# Altium project Switch Video con PIC.PRJPCB
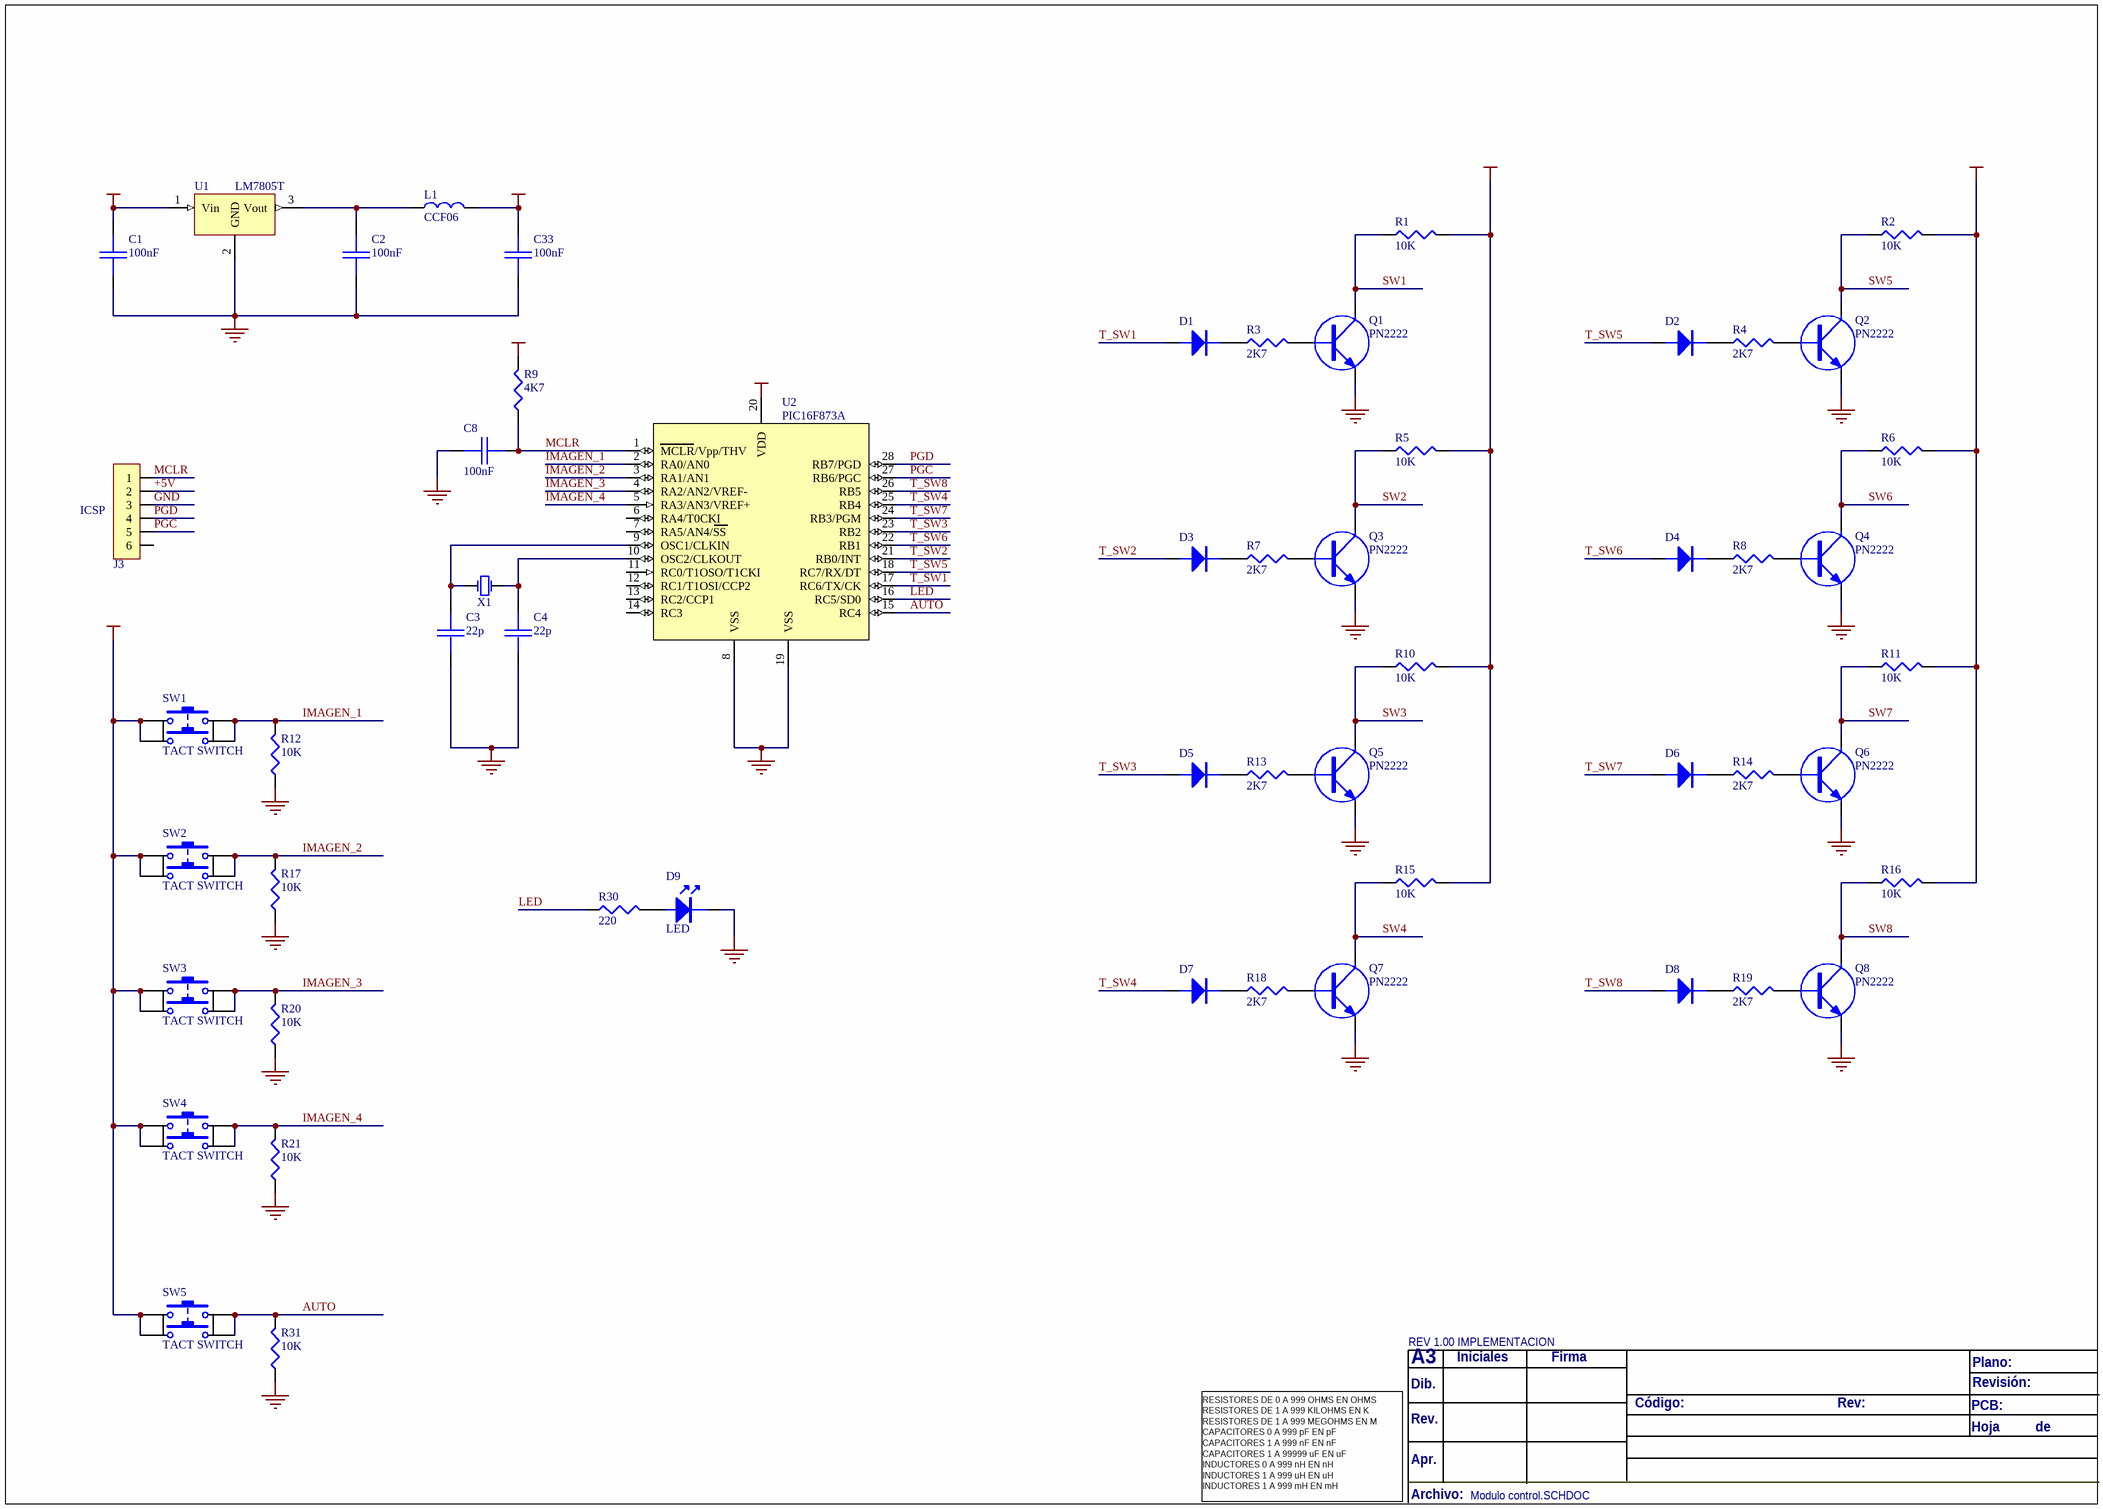
[diagram p0: Modulo control.SCHDOC]
2 sheets, 138 parts. Net scope: global (net labels, ports and power ports of the same name join across sheets).
Board files: Switch Video con PIC.PCBDOC, Armado.PCBDOC
Sheets:
  Modulo control.SCHDOC
  Switch Video con PIC.SCHDOC

## Sheet Modulo control.SCHDOC
size A3; PageSetup: Record=PageOptions|CenterHorizontal=True|CenterVertical=True|PrintScale=0.50|XCorrection=1.00|YCorrection=1.00|PrintKind=1|BorderSize=5000000|LeftOffset=0|BottomOffset=0|Orientation=1|PaperLength=1000|PaperWidth=1000|Scale=100|PaperSource=7|PrintQuality=-4|MediaType=1|DitherType=10|PaperKind=A4|PrintScaleMode=1

### Parts
C1  100nF  [0805]
C2  100nF  [0805]
C3  22p  [CAP5.08]
C4  22p  [CAP5.08]
C8  100nF  [0805]
C33  100nF  [0805]
D1  1N4148 DO-35  [DO-35_300]  (value not drawn)
D2  1N4148 DO-35  [DO-35_300]  (value not drawn)
D3  1N4148 DO-35  [DO-35_300]  (value not drawn)
D4  1N4148 DO-35  [DO-35_300]  (value not drawn)
D5  1N4148 DO-35  [DO-35_300]  (value not drawn)
D6  1N4148 DO-35  [DO-35_300]  (value not drawn)
D7  1N4148 DO-35  [DO-35_300]  (value not drawn)
D8  1N4148 DO-35  [DO-35_300]  (value not drawn)
D9  LED  [LED 3MM]
J3  HEADER6  [JUMPER_6A]  (value not drawn)
L1  CCF06  [AXIAL10X4_300]
Q1  PN2222  [TO-92C]
Q2  PN2222  [TO-92C]
Q3  PN2222  [TO-92C]
Q4  PN2222  [TO-92C]
Q5  PN2222  [TO-92C]
Q6  PN2222  [TO-92C]
Q7  PN2222  [TO-92C]
Q8  PN2222  [TO-92C]
R1  10K  [RES_MF1/2W_200]
R2  10K  [RES_MF1/2W_200]
R3  2K7  [RES_MF1/2W_200]
R4  2K7  [RES_MF1/2W_200]
R5  10K  [RES_MF1/2W_200]
R6  10K  [RES_MF1/2W_200]
R7  2K7  [RES_MF1/2W_200]
R8  2K7  [RES_MF1/2W_200]
R9  4K7  [RES_MF1/2W_200]
R10  10K  [RES_MF1/2W_200]
R11  10K  [RES_MF1/2W_200]
R12  10K  [RES_MF1/2W_200]
R13  2K7  [RES_MF1/2W_200]
R14  2K7  [RES_MF1/2W_200]
R15  10K  [RES_MF1/2W_200]
R16  10K  [RES_MF1/2W_200]
R17  10K  [RES_MF1/2W_200]
R18  2K7  [RES_MF1/2W_200]
R19  2K7  [RES_MF1/2W_200]
R20  10K  [RES_MF1/2W_200]
R21  10K  [RES_MF1/2W_200]
R30  220  [0805]
R31  10K  [RES_MF1/2W_200]
SW1  TACT SWITCH  [PULSADOR 6X6]
SW2  TACT SWITCH  [PULSADOR 6X6]
SW3  TACT SWITCH  [PULSADOR 6X6]
SW4  TACT SWITCH  [PULSADOR 6X6]
SW5  TACT SWITCH  [PULSADOR 6X6]
U1  LM7805T  [TO-220_1]
U2  PIC16F873A  [DIP28F]
X1  XL20M-UM5  [UM5]  (value not drawn)

### Nets
+5V: C33.1 J3.2 L1.2 R9.2 SW1.1 SW1.3 SW2.1 SW2.3 SW3.1 SW3.3 SW4.1 SW4.3 SW5.1 SW5.3 U2.20(VDD)
GND: C1.2 C2.2 C3.1 C4.1 C8.1 C33.2 D9.K J3.3 Q1.1(E) Q2.1(E) Q3.1(E) Q4.1(E) Q5.1(E) Q6.1(E) Q7.1(E) Q8.1(E) R12.1 R17.1 R20.1 R21.1 R31.1 U1.2(GND) U2.8(VSS) U2.19(VSS)
VCC: C1.1 R1.2 R2.2 R5.2 R6.2 R10.2 R11.2 R15.2 R16.2 U1.1(Vin)
AUTO: R31.2 SW5.2 SW5.4 U2.15(RC4)
IMAGEN_1: R12.2 SW1.2 SW1.4 U2.2(RA0/AN0)
IMAGEN_2: R17.2 SW2.2 SW2.4 U2.3(RA1/AN1)
IMAGEN_3: R20.2 SW3.2 SW3.4 U2.4(RA2/AN2/VREF-)
IMAGEN_4: R21.2 SW4.2 SW4.4 U2.5(RA3/AN3/VREF+)
LED: R30.1 U2.16(RC5/SD0)
MCLR: C8.2 J3.1 R9.1 U2.1(MCLR/Vpp/THV)
PGC: J3.5 U2.27(RB6/PGC)
PGD: J3.4 U2.28(RB7/PGD)
SW1: Q1.3(C) R1.1
SW2: Q3.3(C) R5.1
SW3: Q5.3(C) R10.1
SW4: Q7.3(C) R15.1
SW5: Q2.3(C) R2.1
SW6: Q4.3(C) R6.1
SW7: Q6.3(C) R11.1
SW8: Q8.3(C) R16.1
T_SW1: D1.A U2.17(RC6/TX/CK)
T_SW2: D3.A U2.21(RB0/INT)
T_SW3: D5.A U2.23(RB2)
T_SW4: D7.A U2.25(RB4)
T_SW5: D2.A U2.18(RC7/RX/DT)
T_SW6: D4.A U2.22(RB1)
T_SW7: D6.A U2.24(RB3/PGM)
T_SW8: D8.A U2.26(RB5)
NetC2_1: C2.1 L1.1 U1.3(Vout)
NetC3_2: C3.2 U2.9(OSC1/CLKIN) X1.2(OSC2)
NetC4_2: C4.2 U2.10(OSC2/CLKOUT) X1.1(OSC1)
NetD1_K: D1.K R3.1
NetD2_K: D2.K R4.1
NetD3_K: D3.K R7.1
NetD4_K: D4.K R8.1
NetD5_K: D5.K R13.1
NetD6_K: D6.K R14.1
NetD7_K: D7.K R18.1
NetD8_K: D8.K R19.1
NetD9_A: D9.A R30.2
NetQ1_2: Q1.2(B) R3.2
NetQ2_2: Q2.2(B) R4.2
NetQ3_2: Q3.2(B) R7.2
NetQ4_2: Q4.2(B) R8.2
NetQ5_2: Q5.2(B) R13.2
NetQ6_2: Q6.2(B) R14.2
NetQ7_2: Q7.2(B) R18.2
NetQ8_2: Q8.2(B) R19.2

Not connected (* = marked no-connect by the designer): J3 6; U2 6(RA4/T0CKI) 7(RA5/AN4/SS) 11(RC0/T1OSO/T1CKI) 12(RC1/T1OSI/CCP2) 13(RC2/CCP1) 14(RC3)

### Notes on the sheet
- (near J3) ICSP
- REV 1.00 IMPLEMENTACION
- Dib.
- A3
- Iniciales
- Firma
- Plano:
- Revisión:
- Rev.
- Apr.
- Código:
- Rev:
- Hoja          de
- PCB:
- RESISTORES DE 0 A 999 OHMS EN OHMS
  RESISTORES DE 1 A 999 KILOHMS EN K
  RESISTORES DE 1 A 999 MEGOHMS EN M
  CAPACITORES 0 A 999 pF EN pF
  CAPACITORES 1 A 999 nF EN nF
  CAPACITORES 1 A 99999 uF EN uF
  INDUCTORES 0 A 999 nH EN nH
  INDUCTORES 1 A 999 uH EN uH
  INDUCTORES 1 A 999 mH EN mH
- Archivo:

### Library data of the parts
C1 C2 C8 C33 = 100n: CAPACITOR SMD 0805 X7R  50 V 100 nF; CODIGO: YSBC104AAG
C3 C4 = 22p: CAPACITOR PLATE NP0 100V PASO 2.54 mm 22 pF; CODIGO: YPA0220BAG
D1-D8 = 1N4148 DO-35: 1N4148 DO-35 DIODO; CODIGO: DR00006ABH
D9 = LED AMARILLO 3MM: CODIGO: DLRA030XCG
J3 = HEADER6: TIRA MOLEX 1X6 11MM MACHO RECTA PARA PCB
L1 = CCF06: INDUCTOR CCF06; CODIGO: LC0000003G
Q1-Q8 = PN2222: PN2222 TO-92 NPN TRANSISTOR; CODIGO: QS00001AAG
R1 R2 R5 R6 R10-R12 R15-R17 R20 R21 R31 = 10K: RESISTOR METAL FILM 0.5 W 5% 10 KILOHMS; CODIGO: RMC00103EG
R3 R4 R7 R8 R13 R14 R18 R19 = 2K7: RESISTOR METAL FILM 0.5 W 5% 2.7 KILOHMS; CODIGO: RMC00272EG
R9 = 4K7: RESISTOR METAL FILM 0.5 W 5% 4.7 KILOHMS; CODIGO: RMC00472EG
R30 = 220: RESISTOR SMD0805 0.125 W 5%  220 OHMS; CODIGO: RSB00221EG
SW1-SW5 = SW-PB: TACT SWITCH 6X6X12MM 4PINES TSWTS065; CODIGO: KM0000001H
U1 = LM7805T: LM7805T TO-220 CIRC INT; CODIGO: UV00001EBG
U2 = PIC-16F873A: PIC-16F873A - I/SP DIP28 7.62 MM; CODIGO: UI00001AMG
X1 = XL20M-UM5: XL20M-UM5 CRISTAL DE 20 MHZ 10ppm; CODIGO: XXAC00012H

## Sheet Switch Video con PIC.SCHDOC
size A3; PageSetup: Record=PageOptions|CenterHorizontal=True|CenterVertical=True|PrintScale=0.50|XCorrection=1.00|YCorrection=1.00|PrintKind=1|BorderSize=5000000|LeftOffset=0|BottomOffset=0|Orientation=1|PaperLength=1000|PaperWidth=1000|Scale=100|PaperSource=7|PrintQuality=-4|MediaType=1|DitherType=10|PaperKind=A4|PrintScaleMode=1
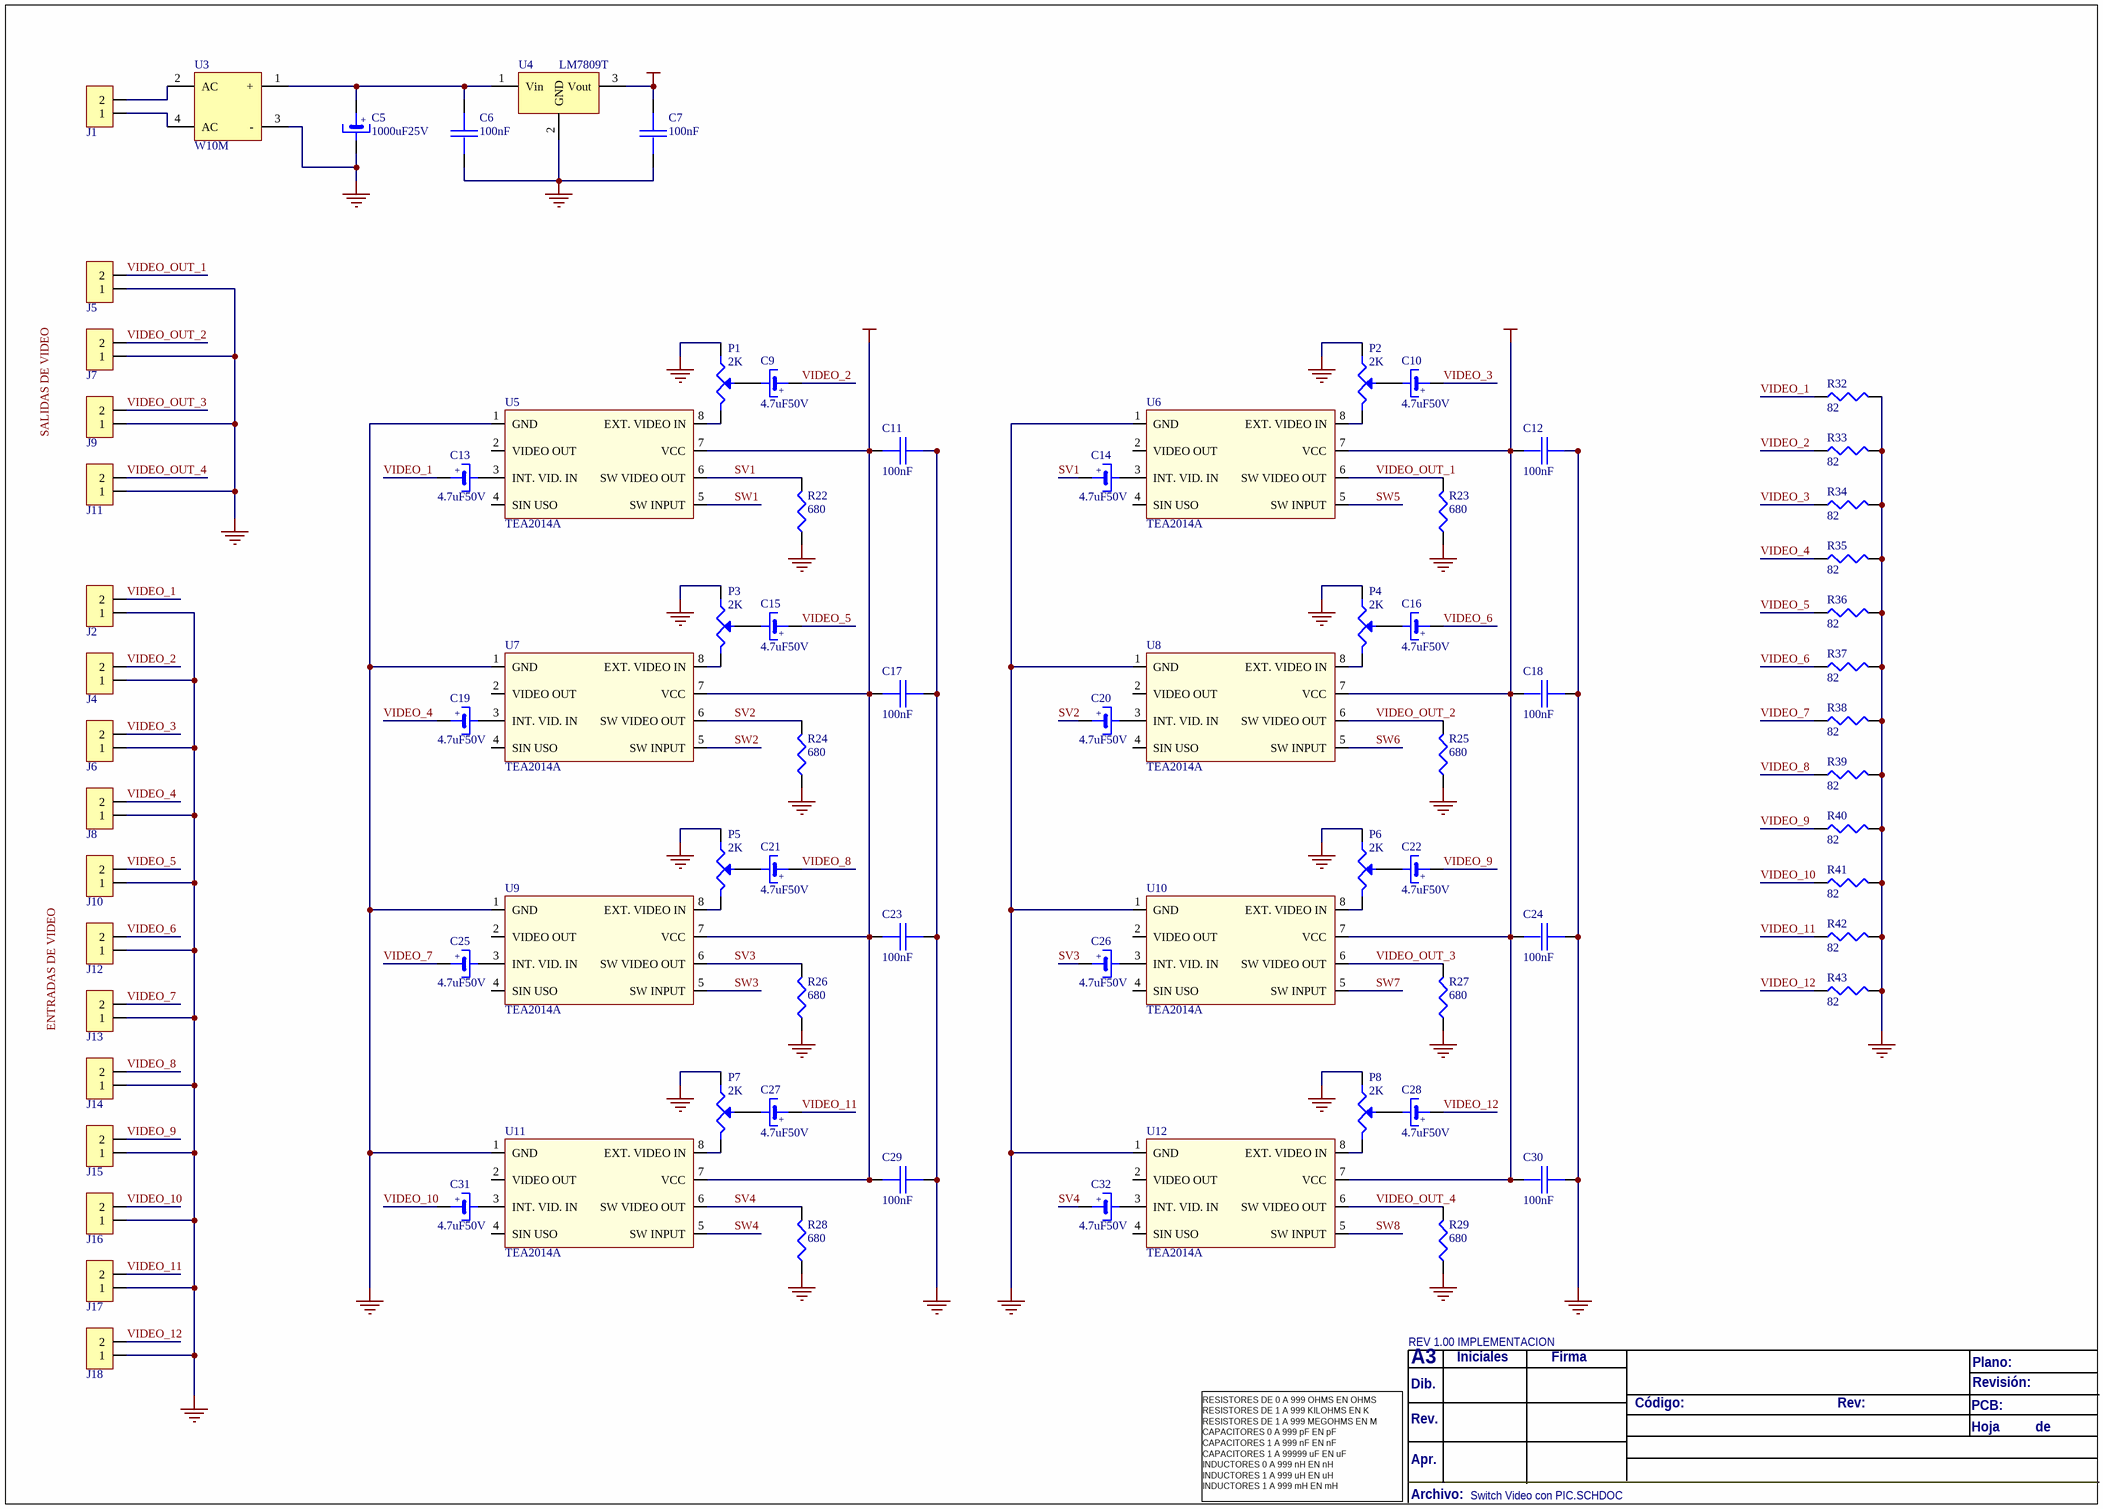
[diagram p1: Switch Video con PIC.SCHDOC]

### Parts
C5  1000uF25V  [CE 5.0/12.5]
C6  100nF  [0805]
C7  100nF  [0805]
C9  4.7uF50V  [CE 2.5/5.0]
C10  4.7uF50V  [CE 2.5/5.0]
C11  100nF  [CAP5.08]
C12  100nF  [CAP5.08]
C13  4.7uF50V  [CE 2.5/5.0]
C14  4.7uF50V  [CE 2.5/5.0]
C15  4.7uF50V  [CE 2.5/5.0]
C16  4.7uF50V  [CE 2.5/5.0]
C17  100nF  [CAP5.08]
C18  100nF  [CAP5.08]
C19  4.7uF50V  [CE 2.5/5.0]
C20  4.7uF50V  [CE 2.5/5.0]
C21  4.7uF50V  [CE 2.5/5.0]
C22  4.7uF50V  [CE 2.5/5.0]
C23  100nF  [CAP5.08]
C24  100nF  [CAP5.08]
C25  4.7uF50V  [CE 2.5/5.0]
C26  4.7uF50V  [CE 2.5/5.0]
C27  4.7uF50V  [CE 2.5/5.0]
C28  4.7uF50V  [CE 2.5/5.0]
C29  100nF  [CAP5.08]
C30  100nF  [CAP5.08]
C31  4.7uF50V  [CE 2.5/5.0]
C32  4.7uF50V  [CE 2.5/5.0]
J1  PW2S  [PW2S]  (value not drawn)
J2  PW2S  [PW2S]  (value not drawn)
J4  PW2S  [PW2S]  (value not drawn)
J5  PW2S  [PW2S]  (value not drawn)
J6  PW2S  [PW2S]  (value not drawn)
J7  PW2S  [PW2S]  (value not drawn)
J8  PW2S  [PW2S]  (value not drawn)
J9  PW2S  [PW2S]  (value not drawn)
J10  PW2S  [PW2S]  (value not drawn)
J11  PW2S  [PW2S]  (value not drawn)
J12  PW2S  [PW2S]  (value not drawn)
J13  PW2S  [PW2S]  (value not drawn)
J14  PW2S  [PW2S]  (value not drawn)
J15  PW2S  [PW2S]  (value not drawn)
J16  PW2S  [PW2S]  (value not drawn)
J17  PW2S  [PW2S]  (value not drawn)
J18  PW2S  [PW2S]  (value not drawn)
P1  2K  [BOURNS3296W]
P2  2K  [BOURNS3296W]
P3  2K  [BOURNS3296W]
P4  2K  [BOURNS3296W]
P5  2K  [BOURNS3296W]
P6  2K  [BOURNS3296W]
P7  2K  [BOURNS3296W]
P8  2K  [BOURNS3296W]
R22  680  [RES_MF1/2W_200]
R23  680  [RES_MF1/2W_200]
R24  680  [RES_MF1/2W_200]
R25  680  [RES_MF1/2W_200]
R26  680  [RES_MF1/2W_200]
R27  680  [RES_MF1/2W_200]
R28  680  [RES_MF1/2W_200]
R29  680  [RES_MF1/2W_200]
R32  82  [0805]
R33  82  [0805]
R34  82  [0805]
R35  82  [0805]
R36  82  [0805]
R37  82  [0805]
R38  82  [0805]
R39  82  [0805]
R40  82  [0805]
R41  82  [0805]
R42  82  [0805]
R43  82  [0805]
U3  W10M  [CASE22]
U4  LM7809T  [TO-220_1]
U5  TEA2014A  [DIP8]
U6  TEA2014A  [DIP8]
U7  TEA2014A  [DIP8]
U8  TEA2014A  [DIP8]
U9  TEA2014A  [DIP8]
U10  TEA2014A  [DIP8]
U11  TEA2014A  [DIP8]
U12  TEA2014A  [DIP8]

### Nets
GND: C5.2 C6.1 C7.1 C11.2 C12.2 C17.2 C18.2 C23.2 C24.2 C29.2 C30.2 J2.1 J4.1 J5.1 J6.1 J7.1 J8.1 J9.1 J10.1 J11.1 J12.1 J13.1 J14.1 J15.1 J16.1 J17.1 J18.1 P1.1 P2.1 P3.1 P4.1 P5.1 P6.1 P7.1 P8.1 R22.1 R23.1 R24.1 R25.1 R26.1 R27.1 R28.1 R29.1 R32.2 R33.2 R34.2 R35.2 R36.2 R37.2 R38.2 R39.2 R40.2 R41.2 R42.2 R43.2 U3.3(-) U4.2(GND) U5.1(GND) U6.1(GND) U7.1(GND) U8.1(GND) U9.1(GND) U10.1(GND) U11.1(GND) U12.1(GND)
VCC: C7.2 C11.1 C12.1 C17.1 C18.1 C23.1 C24.1 C29.1 C30.1 U4.3(Vout) U5.7(VCC) U6.7(VCC) U7.7(VCC) U8.7(VCC) U9.7(VCC) U10.7(VCC) U11.7(VCC) U12.7(VCC)
SV1: C14.1 R22.2 U5.6(SW_VIDEO_OUT)
SV2: C20.1 R24.2 U7.6(SW_VIDEO_OUT)
SV3: C26.1 R26.2 U9.6(SW_VIDEO_OUT)
SV4: C32.1 R28.2 U11.6(SW_VIDEO_OUT)
SW1: U5.5(SW_INPUT)
SW2: U7.5(SW_INPUT)
SW3: U9.5(SW_INPUT)
SW4: U11.5(SW_INPUT)
SW5: U6.5(SW_INPUT)
SW6: U8.5(SW_INPUT)
SW7: U10.5(SW_INPUT)
SW8: U12.5(SW_INPUT)
VIDEO_1: C13.1 J2.2 R32.1
VIDEO_2: C9.1 J4.2 R33.1
VIDEO_3: C10.1 J6.2 R34.1
VIDEO_4: C19.1 J8.2 R35.1
VIDEO_5: C15.1 J10.2 R36.1
VIDEO_6: C16.1 J12.2 R37.1
VIDEO_7: C25.1 J13.2 R38.1
VIDEO_8: C21.1 J14.2 R39.1
VIDEO_9: C22.1 J15.2 R40.1
VIDEO_10: C31.1 J16.2 R41.1
VIDEO_11: C27.1 J17.2 R42.1
VIDEO_12: C28.1 J18.2 R43.1
VIDEO_OUT_1: J5.2 R23.2 U6.6(SW_VIDEO_OUT)
VIDEO_OUT_2: J7.2 R25.2 U8.6(SW_VIDEO_OUT)
VIDEO_OUT_3: J9.2 R27.2 U10.6(SW_VIDEO_OUT)
VIDEO_OUT_4: J11.2 R29.2 U12.6(SW_VIDEO_OUT)
NetC5_1: C5.1 C6.2 U3.1(+) U4.1(Vin)
NetC9_2: C9.2 P1.2
NetC10_2: C10.2 P2.2
NetC13_2: C13.2 U5.3(INT._VID._IN)
NetC14_2: C14.2 U6.3(INT._VID._IN)
NetC15_2: C15.2 P3.2
NetC16_2: C16.2 P4.2
NetC19_2: C19.2 U7.3(INT._VID._IN)
NetC20_2: C20.2 U8.3(INT._VID._IN)
NetC21_2: C21.2 P5.2
NetC22_2: C22.2 P6.2
NetC25_2: C25.2 U9.3(INT._VID._IN)
NetC26_2: C26.2 U10.3(INT._VID._IN)
NetC27_2: C27.2 P7.2
NetC28_2: C28.2 P8.2
NetC31_2: C31.2 U11.3(INT._VID._IN)
NetC32_2: C32.2 U12.3(INT._VID._IN)
NetJ1_1: J1.1 U3.4(AC)
NetJ1_2: J1.2 U3.2(AC)
NetP1_3: P1.3 U5.8(EXT._VIDEO_IN)
NetP2_3: P2.3 U6.8(EXT._VIDEO_IN)
NetP3_3: P3.3 U7.8(EXT._VIDEO_IN)
NetP4_3: P4.3 U8.8(EXT._VIDEO_IN)
NetP5_3: P5.3 U9.8(EXT._VIDEO_IN)
NetP6_3: P6.3 U10.8(EXT._VIDEO_IN)
NetP7_3: P7.3 U11.8(EXT._VIDEO_IN)
NetP8_3: P8.3 U12.8(EXT._VIDEO_IN)

Not connected (* = marked no-connect by the designer): U5 2(VIDEO_OUT) 4(SIN_USO); U6 2(VIDEO_OUT) 4(SIN_USO); U7 2(VIDEO_OUT) 4(SIN_USO); U8 2(VIDEO_OUT) 4(SIN_USO); U9 2(VIDEO_OUT) 4(SIN_USO); U10 2(VIDEO_OUT) 4(SIN_USO); U11 2(VIDEO_OUT) 4(SIN_USO); U12 2(VIDEO_OUT) 4(SIN_USO)

### Notes on the sheet
- Labels drawn without touching a wire or pin: ENTRADAS DE VIDEO, SALIDAS DE VIDEO
- REV 1.00 IMPLEMENTACION
- Dib.
- A3
- Iniciales
- Firma
- Plano:
- Revisión:
- Rev.
- Apr.
- Código:
- Rev:
- Hoja          de
- PCB:
- RESISTORES DE 0 A 999 OHMS EN OHMS
  RESISTORES DE 1 A 999 KILOHMS EN K
  RESISTORES DE 1 A 999 MEGOHMS EN M
  CAPACITORES 0 A 999 pF EN pF
  CAPACITORES 1 A 999 nF EN nF
  CAPACITORES 1 A 99999 uF EN uF
  INDUCTORES 0 A 999 nH EN nH
  INDUCTORES 1 A 999 uH EN uH
  INDUCTORES 1 A 999 mH EN mH
- Archivo:
- (in symbol 4.7uF50V) +
- (in symbol 1000uF25V HFC) +

### Library data of the parts
C5 = 1000uF25V HFC: CAPACITOR ELECTROLITICO RADIAL  HFC EPCOS 12.5 X 20 mm PASO 5 mm +/-20% 105ºC 25V 1000uF; CODIGO: YXNH001EBG
C6 C7 = 100n: as C1 on sheet Modulo control
C9 C10 C13-C16 C19-C22 C25-C28 C31 C32 = 4.7uF50V: CAPACITOR ELECTROLITICO RADIAL 5 X11mm PASO 2 mm 85ºC +/-20% 50 V 4.7 uF; CODIGO: YEAF475GBG
C11 C12 C17 C18 C23 C24 C29 C30 = 100n: CAPACITOR CERAMICO DISCO 2.54 mm  X7R  50V  100nF; CODIGO: YCAC104AAG
J1 J2 J4-J18 = PW2S: PW2S HEADER .156" RECTO 2 VIAS; CODIGO: JNXEISP02G
P1-P8 = BOURNS 3296W 202: TRIMPOT BOURNS 3296W 2 KILOHMS; CODIGO: RTA202AAKG
R22-R29 = 680: RESISTOR METAL FILM 0.5 W 5% 680 OHMS; CODIGO: RMC00681EG
R32-R43 = 82: RESISTOR SMD0805 0.125 W 5%  82 OHMS; CODIGO: RSB00820EG
U3 = W10M: W10M CASE22 CIRC INT RECTIFICADOR PUENTE 1000V 1A; CODIGO: UU00004HAH
U4 = LM7809T: LM7809T TO-220 CIRC INT; CODIGO: UV00005EBH
U5-U12 = TEA2014A: TEA2014A DIP-8 VIDEO SWITCH

## Nets that join several sheets
GND: Modulo control (24 pins), Switch Video con PIC (65 pins)
VCC: Modulo control (10 pins), Switch Video con PIC (18 pins)
SW1: Modulo control (Q1.3 R1.1), Switch Video con PIC (U5.5)
SW2: Modulo control (Q3.3 R5.1), Switch Video con PIC (U7.5)
SW3: Modulo control (Q5.3 R10.1), Switch Video con PIC (U9.5)
SW4: Modulo control (Q7.3 R15.1), Switch Video con PIC (U11.5)
SW5: Modulo control (Q2.3 R2.1), Switch Video con PIC (U6.5)
SW6: Modulo control (Q4.3 R6.1), Switch Video con PIC (U8.5)
SW7: Modulo control (Q6.3 R11.1), Switch Video con PIC (U10.5)
SW8: Modulo control (Q8.3 R16.1), Switch Video con PIC (U12.5)